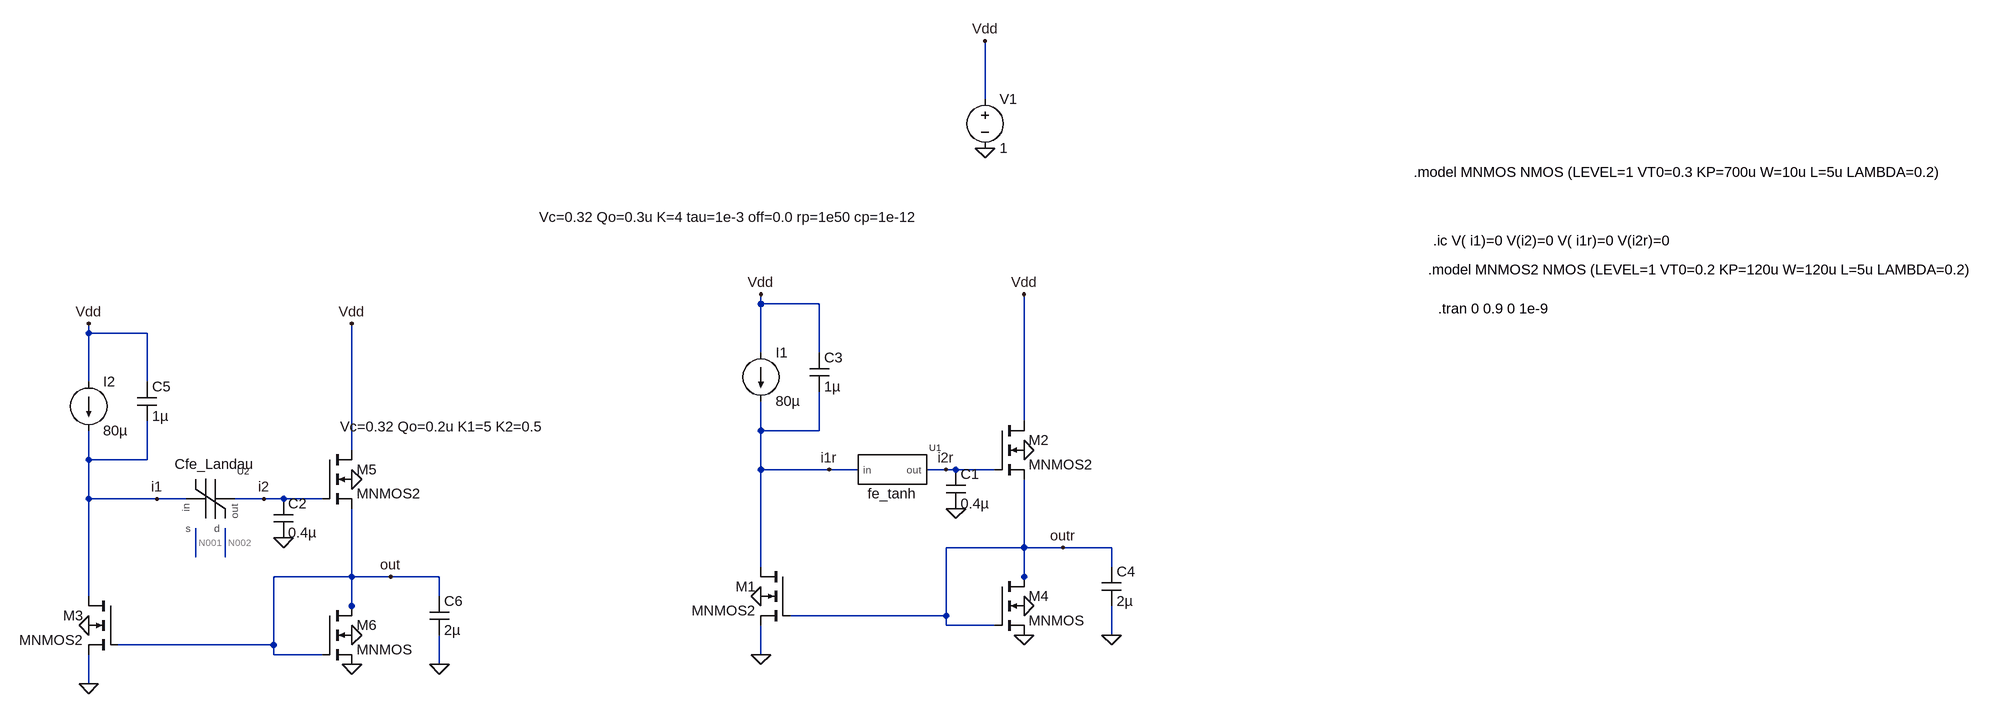
[diagram p0: schematic Neuron_oscillator_test.asc]
Neuron_oscillator_test.asc, the LTspice schematic file:
Version 4
SHEET 1 1192 680
WIRE -496 -320 -496 -416
WIRE -864 16 -864 0
WIRE -768 16 -864 16
WIRE -1968 64 -1968 48
WIRE -1872 64 -1968 64
WIRE -864 96 -864 16
WIRE -768 96 -768 16
WIRE -1968 144 -1968 64
WIRE -1872 144 -1872 64
WIRE -432 208 -432 0
WIRE -864 224 -864 176
WIRE -768 224 -768 160
WIRE -768 224 -864 224
WIRE -1536 256 -1536 48
WIRE -1968 272 -1968 224
WIRE -1872 272 -1872 208
WIRE -1872 272 -1968 272
WIRE -864 288 -864 224
WIRE -752 288 -864 288
WIRE -704 288 -752 288
WIRE -560 288 -592 288
WIRE -544 288 -560 288
WIRE -480 288 -544 288
WIRE -1968 336 -1968 272
WIRE -1856 336 -1968 336
WIRE -1808 336 -1856 336
WIRE -1680 336 -1728 336
WIRE -1648 336 -1680 336
WIRE -1584 336 -1648 336
WIRE -432 416 -432 304
WIRE -432 416 -560 416
WIRE -368 416 -432 416
WIRE -288 416 -368 416
WIRE -1792 432 -1792 384
WIRE -1744 432 -1744 384
WIRE -864 448 -864 288
WIRE -288 448 -288 416
WIRE -1536 464 -1536 352
WIRE -1536 464 -1664 464
WIRE -1472 464 -1536 464
WIRE -1392 464 -1472 464
WIRE -432 464 -432 416
WIRE -432 480 -432 464
WIRE -1968 496 -1968 336
WIRE -1392 496 -1392 464
WIRE -1536 512 -1536 464
WIRE -1536 528 -1536 512
WIRE -560 528 -560 416
WIRE -560 528 -816 528
WIRE -560 544 -560 528
WIRE -480 544 -560 544
WIRE -288 560 -288 512
WIRE -1664 576 -1664 464
WIRE -1664 576 -1920 576
WIRE -1664 592 -1664 576
WIRE -1584 592 -1664 592
WIRE -864 592 -864 544
WIRE -1392 608 -1392 560
WIRE -1968 640 -1968 592
FLAG -496 -240 0
FLAG -496 -416 Vdd
FLAG -1968 640 0
FLAG -1968 544 0
FLAG -1968 48 Vdd
FLAG -1536 48 Vdd
FLAG -1536 304 0
FLAG -1648 400 0
FLAG -1856 336 i1
FLAG -1680 336 i2
FLAG -1392 608 0
FLAG -1536 608 0
FLAG -1536 560 0
FLAG -1472 464 out
FLAG -864 592 0
FLAG -864 496 0
FLAG -864 0 Vdd
FLAG -432 0 Vdd
FLAG -432 256 0
FLAG -544 352 0
FLAG -752 288 i1r
FLAG -288 560 0
FLAG -432 560 0
FLAG -432 512 0
FLAG -368 416 outr
FLAG -560 288 i2r
SYMBOL voltage -496 -336 R0
WINDOW 123 0 0 Left 0
WINDOW 39 0 0 Left 0
SYMATTR InstName V1
SYMATTR Value 1
SYMBOL nmos4 -1920 496 M0
SYMATTR InstName M3
SYMATTR Value MNMOS2
SYMBOL nmos4 -1584 256 R0
SYMATTR InstName M5
SYMATTR Value MNMOS2
SYMBOL cap -1664 336 R0
SYMATTR InstName C2
SYMATTR Value 0.4µ
SYMBOL current -1968 144 R0
WINDOW 123 0 0 Left 0
WINDOW 39 0 0 Left 0
SYMATTR InstName I2
SYMATTR Value 80µ
SYMBOL cap -1888 144 R0
SYMATTR InstName C5
SYMATTR Value 1µ
SYMBOL cap -1408 496 R0
SYMATTR InstName C6
SYMATTR Value 2µ
SYMBOL nmos4 -1584 512 R0
SYMATTR InstName M6
SYMATTR Value MNMOS
SYMBOL Cfe_Landau -1696 384 R0
SYMATTR SpiceLine Vc=0.32 Qo=0.2u K1=5 K2=0.5
SYMATTR InstName U2
SYMBOL nmos4 -816 448 M0
SYMATTR InstName M1
SYMATTR Value MNMOS2
SYMBOL nmos4 -480 208 R0
SYMATTR InstName M2
SYMATTR Value MNMOS2
SYMBOL cap -560 288 R0
SYMATTR InstName C1
SYMATTR Value 0.4µ
SYMBOL current -864 96 R0
WINDOW 123 0 0 Left 0
WINDOW 39 0 0 Left 0
SYMATTR InstName I1
SYMATTR Value 80µ
SYMBOL cap -784 96 R0
SYMATTR InstName C3
SYMATTR Value 1µ
SYMBOL cap -304 448 R0
SYMATTR InstName C4
SYMATTR Value 2µ
SYMBOL nmos4 -480 464 R0
SYMATTR InstName M4
SYMATTR Value MNMOS
SYMBOL fe_tanh -656 288 R0
WINDOW 39 -257 -430 Top 2
SYMATTR SpiceLine Vc=0.32 Qo=0.3u K=4 tau=1e-3 off=0.0 rp=1e50 cp=1e-12
SYMATTR InstName U1
TEXT 208 -200 Left 2 !.model MNMOS NMOS (LEVEL=1 VT0=0.3 KP=700u W=10u L=5u LAMBDA=0.2)
TEXT 248 24 Left 2 !.tran 0 0.9 0 1e-9
TEXT 240 -88 Left 2 !.ic V( i1)=0 V(i2)=0 V( i1r)=0 V(i2r)=0
TEXT 232 -40 Left 2 !.model MNMOS2 NMOS (LEVEL=1 VT0=0.2 KP=120u W=120u L=5u LAMBDA=0.2)

The netlist it stands for:
* Neuron_oscillator_test.asc
V1 Vdd 0 1
M3 i1 out 0 0 MNMOS2
M5 Vdd i2 out 0 MNMOS2
C2 i2 0 0.4µ
I2 Vdd i1 80µ
C5 Vdd i1 1µ
C6 out 0 2µ
M6 out out 0 0 MNMOS
XU2 i1 i2 N001 N002 Cfe_Landau Vc=0.32 Qo=0.2u K1=5 K2=0.5  ; pins in out s d
M1 i1r outr 0 0 MNMOS2
M2 Vdd i2r outr 0 MNMOS2
C1 i2r 0 0.4µ
I1 Vdd i1r 80µ
C3 Vdd i1r 1µ
C4 outr 0 2µ
M4 outr outr 0 0 MNMOS
XU1 i1r i2r fe_tanh Vc=0.32 Qo=0.3u K=4 tau=1e-3 off=0.0 rp=1e50 cp=1e-12  ; pins in out
.model NMOS NMOS
.model PMOS PMOS
.lib standard.mos
.model MNMOS NMOS (LEVEL=1 VT0=0.3 KP=700u W=10u L=5u LAMBDA=0.2)
.tran 0 0.9 0 1e-9
.ic V( i1)=0 V(i2)=0 V( i1r)=0 V(i2r)=0
.model MNMOS2 NMOS (LEVEL=1 VT0=0.2 KP=120u W=120u L=5u LAMBDA=0.2)
.lib C:\Users\MBX\Desktop\Investigacion\FeFET-Neuron\Neuron\Cfe_Landau.sp
.lib ./fe_tanh_ni.sp
.backanno
.end

* Results of the author's LTspice run, read from the files saved beside the schematic
* Operating Point, zero values left out:
*   V(vdd) = 1 V
*   V(out) = 245 mV
*   V(n001) = -1 V
*   V(n002) = -1 V
*   V(outr) = 245 mV
*   Id(M5) = 1.765 pA
*   Ib(M5) = -1.265 pA
*   Id(M2) = 1.765 pA
*   Ib(M2) = -1.265 pA
*   I(I2) = 80 µA
*   I(I1) = 80 µA
*   I(V1) = -160 µA
*   Ix(u1:IN) = -1 A
*   Ix(u1:OUT) = 1 A